# EAGLE schematic main2 (EAGLE 9.0.1)
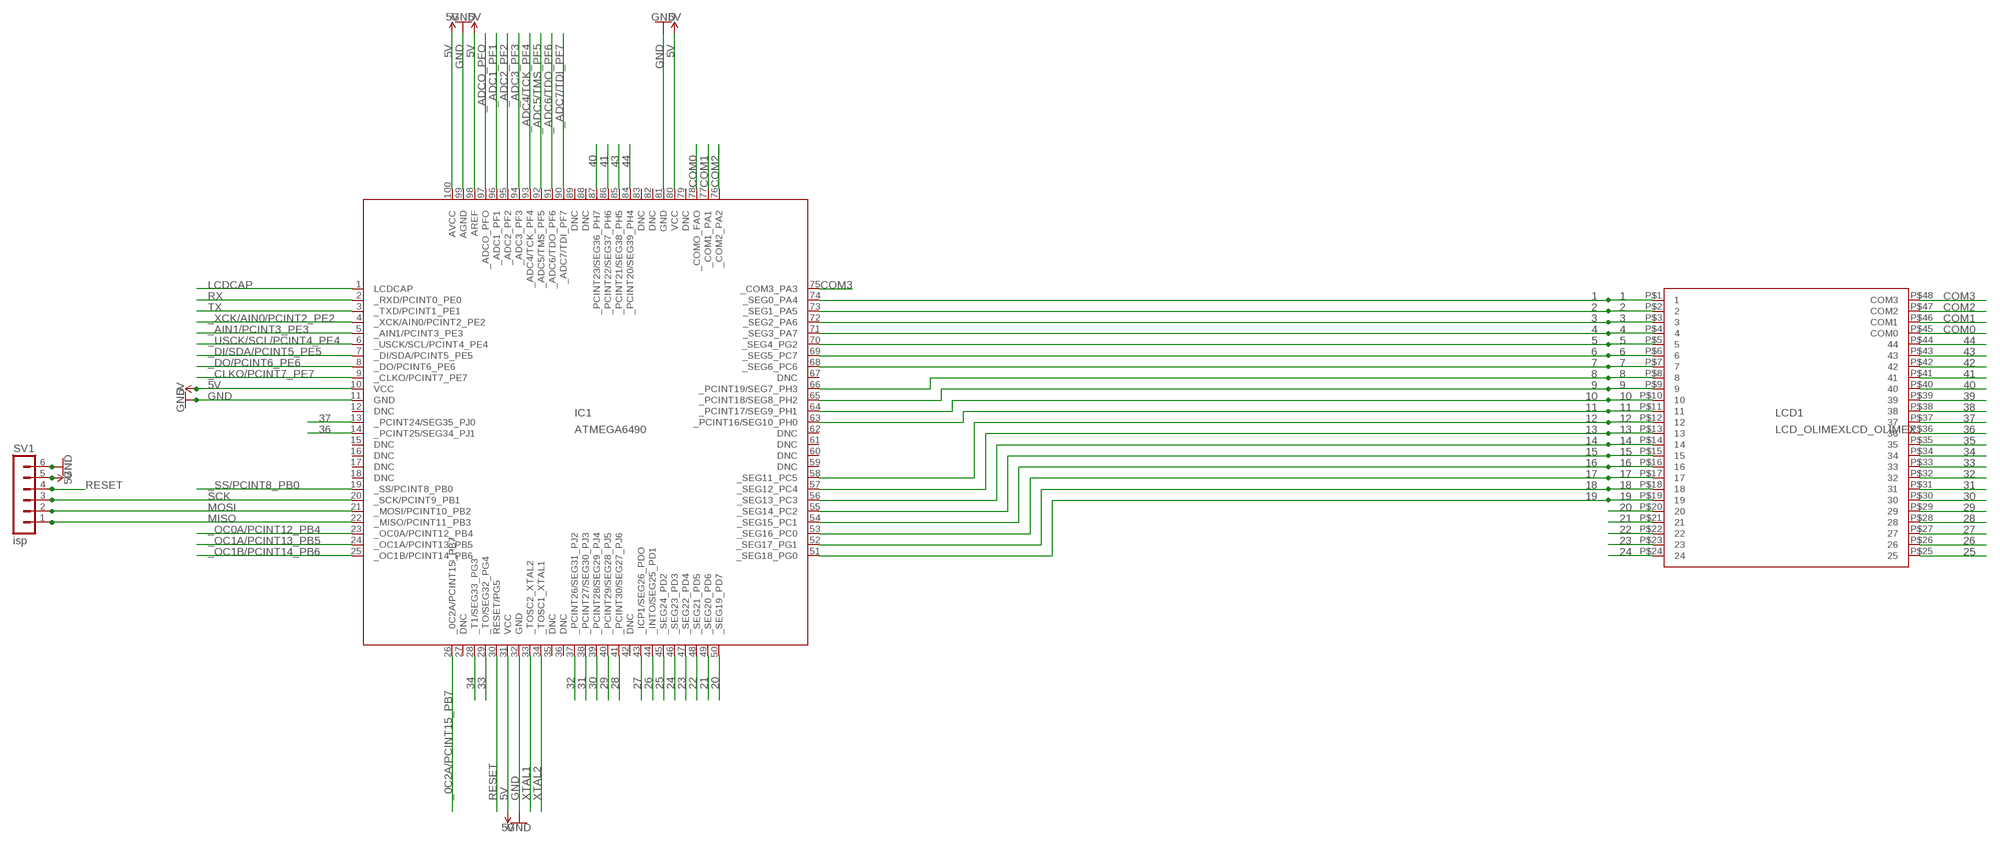
[diagram p0: schematic, sheet 1]

## Parts
IC1  ATMEGA6490  [TQFP100]
LCD1  LCD_OLIMEXLCD_OLIMEX  [LCD_OLIMEX]
SV1  isp  MA06-1  [MA06-1]

## Nets
1: IC1.74(_SEG0_PA4) LCD1.P$1
2: IC1.73(_SEG1_PA5) LCD1.P$2
3: IC1.72(_SEG2_PA6) LCD1.P$3
4: IC1.71(_SEG3_PA7) LCD1.P$4
5: IC1.70(_SEG4_PG2) LCD1.P$5
5V: IC1.10(VCC) IC1.31(VCC) IC1.80(VCC) IC1.98(AREF) IC1.100(AVCC) SV1.5
6: IC1.69(_SEG5_PC7) LCD1.P$6
7: IC1.68(_SEG6_PC6) LCD1.P$7
8: IC1.66(_PCINT19/SEG7_PH3) LCD1.P$8
9: IC1.65(_PCINT18/SEG8_PH2) LCD1.P$9
10: IC1.64(_PCINT17/SEG9_PH1) LCD1.P$10
11: IC1.63(_PCINT16/SEG10_PH0) LCD1.P$11
12: IC1.58(_SEG11_PC5) LCD1.P$12
13: IC1.57(_SEG12_PC4) LCD1.P$13
14: IC1.56(_SEG13_PC3) LCD1.P$14
15: IC1.55(_SEG14_PC2) LCD1.P$15
16: IC1.54(_SEG15_PC1) LCD1.P$16
17: IC1.53(_SEG16_PC0) LCD1.P$17
18: IC1.52(_SEG17_PG1) LCD1.P$18
19: IC1.51(_SEG18_PG0) LCD1.P$19
20: IC1.50(_SEG19_PD7) LCD1.P$20
21: IC1.49(_SEG20_PD6) LCD1.P$21
22: IC1.48(_SEG21_PD5) LCD1.P$22
23: IC1.47(_SEG22_PD4) LCD1.P$23
24: IC1.46(_SEG23_PD3) LCD1.P$24
25: IC1.45(_SEG24_PD2) LCD1.P$25
26: IC1.44(_INTO/SEG25_PD1) LCD1.P$26
27: IC1.43(_ICP1/SEG26_PDO) LCD1.P$27
28: IC1.41(_PCINT30/SEG27_PJ6) LCD1.P$28
29: IC1.40(_PCINT29/SEG28_PJ5) LCD1.P$29
30: IC1.39(_PCINT28/SEG29_PJ4) LCD1.P$30
31: IC1.38(_PCINT27/SEG30_PJ3) LCD1.P$31
32: IC1.37(_PCINT26/SEG31_PJ2) LCD1.P$32
33: IC1.29(_TO/SEG32_PG4) LCD1.P$33
34: IC1.28(_T1/SEG33_PG3) LCD1.P$34
35: LCD1.P$35
36: IC1.14(_PCINT25/SEG34_PJ1) LCD1.P$36
37: IC1.13(_PCINT24/SEG35_PJ0) LCD1.P$37
38: LCD1.P$38
39: LCD1.P$39
40: IC1.87(_PCINT23/SEG36_PH7) LCD1.P$40
41: IC1.86(_PCINT22/SEG37_PH6) LCD1.P$41
42: LCD1.P$42
43: IC1.85(_PCINT21/SEG38_PH5) LCD1.P$43
44: IC1.84(_PCINT20/SEG39_PH4) LCD1.P$44
_0C2A/PCINT15_PB7: IC1.26(_0C2A/PCINT15_PB7)
_ADC1_PF1: IC1.96(_ADC1_PF1)
_ADC2_PF2: IC1.95(_ADC2_PF2)
_ADC3_PF3: IC1.94(_ADC3_PF3)
_ADC4/TCK_PF4: IC1.93(_ADC4/TCK_PF4)
_ADC5/TMS_PF5: IC1.92(_ADC5/TMS_PF5)
_ADC6/TDO_PF6: IC1.91(_ADC6/TDO_PF6)
_ADC7/TDI_PF7: IC1.90(_ADC7/TDI_PF7)
_ADCO_PFO: IC1.97(_ADCO_PFO)
_AIN1/PCINT3_PE3: IC1.5(_AIN1/PCINT3_PE3)
_CLKO/PCINT7_PE7: IC1.9(_CLKO/PCINT7_PE7)
_DI/SDA/PCINT5_PE5: IC1.7(_DI/SDA/PCINT5_PE5)
_DO/PCINT6_PE6: IC1.8(_DO/PCINT6_PE6)
_OC0A/PCINT12_PB4: IC1.23(_OC0A/PCINT12_PB4)
_OC1A/PCINT13_PB5: IC1.24(_OC1A/PCINT13_PB5)
_OC1B/PCINT14_PB6: IC1.25(_OC1B/PCINT14_PB6)
_SS/PCINT8_PB0: IC1.19(_SS/PCINT8_PB0)
_USCK/SCL/PCINT4_PE4: IC1.6(_USCK/SCL/PCINT4_PE4)
_XCK/AIN0/PCINT2_PE2: IC1.4(_XCK/AIN0/PCINT2_PE2)
COM0: IC1.78(_COMO_FAO) LCD1.P$45(COM0)
COM1: IC1.77(_COM1_PA1) LCD1.P$46(COM1)
COM2: IC1.76(_COM2_PA2) LCD1.P$47(COM2)
COM3: IC1.75(_COM3_PA3) LCD1.P$48(COM3)
GND: IC1.11(GND) IC1.32(GND) IC1.81(GND) IC1.99(AGND) SV1.6
LCDCAP: IC1.1(LCDCAP)
MISO: IC1.22(_MISO/PCINT11_PB3) SV1.1
MOSI: IC1.21(_MOSI/PCINT10_PB2) SV1.2
RESET: IC1.30(RESET/PG5) SV1.4
RX: IC1.2(_RXD/PCINT0_PE0)
SCK: IC1.20(_SCK/PCINT9_PB1) SV1.3
TX: IC1.3(_TXD/PCINT1_PE1)
XTAL1: IC1.33(_TOSC2_XTAL2)
XTAL2: IC1.34(_TOSC1_XTAL1)
Unconnected: IC1.12(DNC) IC1.15(DNC) IC1.16(DNC) IC1.17(DNC) IC1.18(DNC) IC1.27(DNC) IC1.35(DNC) IC1.36(DNC) IC1.42(DNC) IC1.59(DNC) IC1.60(DNC) IC1.61(DNC) IC1.62(DNC) IC1.67(DNC) IC1.79(DNC) IC1.82(DNC) IC1.83(DNC) IC1.88(DNC) IC1.89(DNC)

## Library data of the parts
IC1 = 7_segment_lib:ATMEGA6490: temp edit this description Auto generated by make-symbol-device-package-bsdl.ulp Rev. 44 Source: temp.txt
LCD1 = 7_segment_lib:LCD_OLIMEX: Untitled 1 edit this description Auto generated by make-symbol-device-package-bsdl.ulp Rev. 44 Source: Untitled 1.txt
SV1 = con-lstb:MA06-1: PIN HEADER; OC_FARNELL: unknown; OC_NEWARK: unknown